# EAGLE design MainControllerV1 (EAGLE 9.3.1)
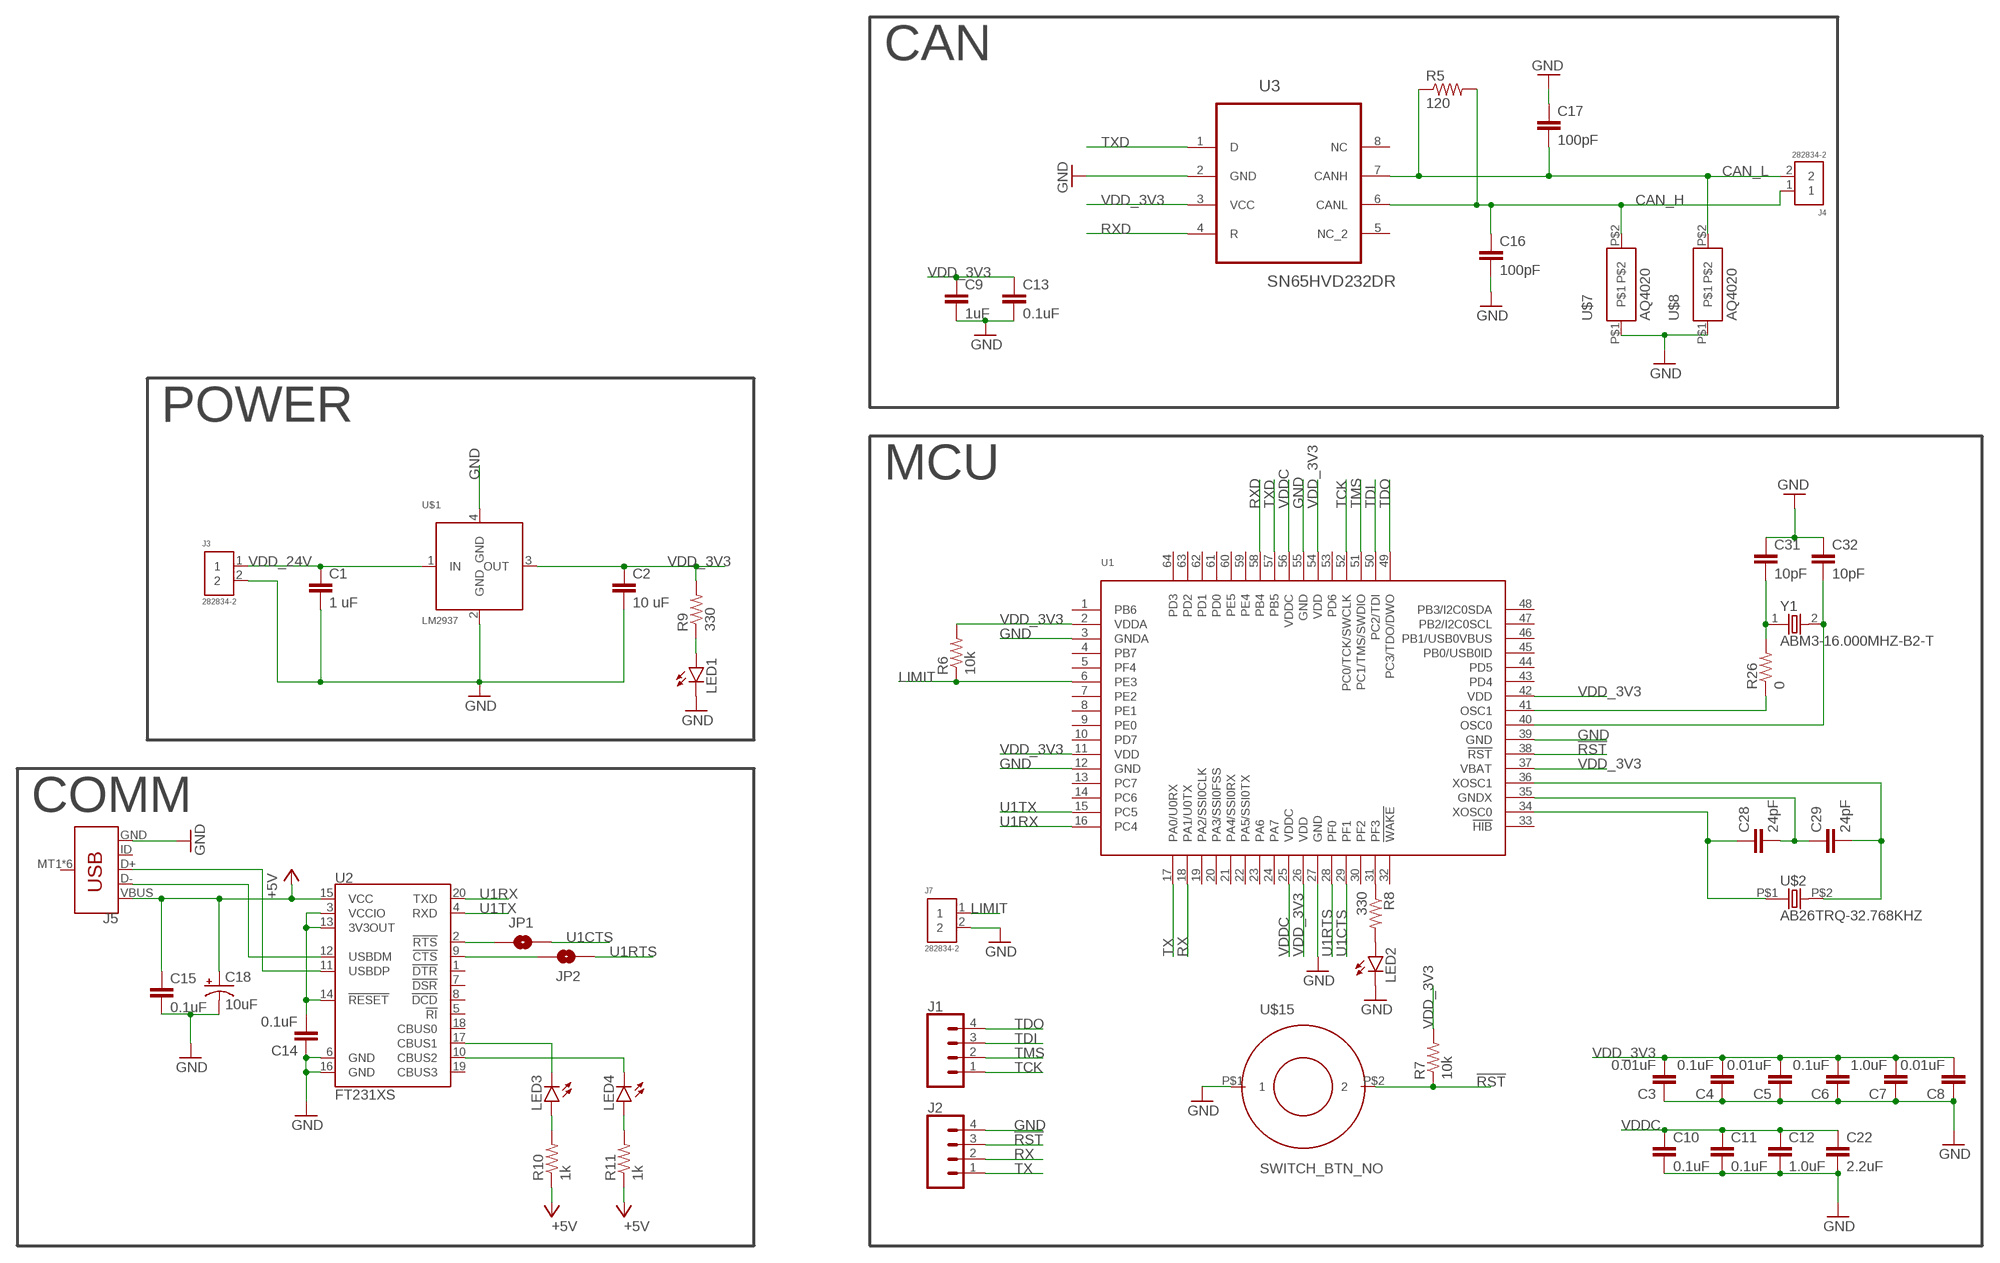
[diagram p0: schematic, sheet 1]

## Parts
C1  1 uF  CAP  [0805]
C2  10 uF  CAP  [0805]
C3  0.01uF  CAP  [0805]
C4  0.1uF  CAP  [0805]
C5  0.01uF  CAP  [0805]
C6  0.1uF  CAP  [0805]
C7  1.0uF  CAP  [0603]
C8  0.01uF  CAP  [0805]
C9  1uF  CAP  [0603]
C10  0.1uF  CAP  [0805]
C11  0.1uF  CAP  [0805]
C12  1.0uF  CAP  [0603]
C13  0.1uF  CAP  [0805]
C14  0.1uF  CAP  [0603]
C15  0.1uF  CAP  [0603]
C16  100pF  CAP  [0603]
C17  100pF  CAP  [0603]
C18  10uF  10UF-POLAR-EIA3216-16V-10%(TANT)  [EIA3216]
C22  2.2uF  CAP  [0805]
C28  24pF  CAP  [0805]
C29  24pF  CAP  [0805]
C31  10pF  CAP  [0805]
C32  10pF  CAP  [0805]
J1  CONN_04  [1X04]
J2  CONN_04  [1X04]
J3  282834-2  [CONN_282834-2]
J4  282834-2  [CONN_282834-2]
J5  USB_MICRO-B_SMT  [USB-MICROB]
J7  282834-2  [CONN_282834-2]
JP1  JUMPER-SMT_2_NO_SILK  [SMT-JUMPER_2_NO_SILK]
JP2  JUMPER-SMT_2_NO_SILK  [SMT-JUMPER_2_NO_SILK]
LED1  LED0603  [LED-0603]
LED2  LED0603  [LED-0603]
LED3  LED0603  [LED-0603]
LED4  LED0603  [LED-0603]
R5  120  RES  [0603]
R6  10k  RES  [0603]
R7  10k  RES  [0603]
R8  330  RES  [0603]
R9  330  RES  [0603]
R10  1k  RES  [0603]
R11  1k  RES  [0603]
R26  0  RES  [0603]
U1  TM4C123GH6PMI  [QFP50P1200X1200X160-64N]
U2  FT231XS  [SSOP20_L]
U3  SN65HVD232DR  [SOIC127P600X175-8N]
U$1  LM2937  [R-PDSO-G4]
U$2  AB26TRQ-32.768KHZ  [AB26TRQ]
U$7  AQ4020  [SOD323]
U$8  AQ4020  [SOD323]
U$15  SWITCH_BTN_NO  [BTN_2]
Y1  ABM3-16.000MHZ-B2-T  [XTAL500X320X130N]

## Nets
!RST: J2.3 R7.P$1 U1.38(!RST) U$15.P$2
+5V: C15.P$1 C18.+ J5.VBUS R10.P$1 R11.P$1 U2.15(VCC)
CAN_H: C16.P$1 J4.1 R5.P$2 U3.6(CANL) U$7.P$2
CAN_L: C17.P$2 J4.2 R5.P$1 U3.7(CANH) U$8.P$2
GND: C1.2 C2.2 C3.1 C4.1 C5.1 C6.1 C7.P$1 C8.1 C9.P$2 C10.2 C11.2 C12.P$2 C13.2 C14.P$1 C15.P$2 C16.P$2 C17.P$1 C18.- C22.2 C31.1 C32.1 J2.4 J3.2 J5.GND J7.2 LED1.C LED2.C U1.3(GNDA) U1.12(GND) U1.27(GND) U1.39(GND) U1.55(GND) U2.6(GND) U2.16(GND) U3.2(GND) U$1.2(GND) U$1.4(GND) U$7.P$1 U$8.P$1 U$15.P$1
LIMIT: J7.1 R6.P$1 U1.6(PE3)
N$1: C29.2 U1.36(XOSC1) U$2.P$2
N$2: C28.1 U1.34(XOSC0) U$2.P$1
N$3: C28.2 C29.1 U1.35(GNDX)
N$4: R26.P$1 U1.41(OSC1)
N$5: LED1.A R9.P$1
N$6: C31.2 R26.P$2 Y1.1
N$7: C32.2 U1.40(OSC0) Y1.2
N$8: LED3.A R10.P$2
N$9: C14.P$2 U2.3(VCCIO) U2.13(3V3OUT) U2.14(!RESET)
N$10: LED3.C U2.17(CBUS1)
N$11: J5.D- U2.12(USBDM)
N$12: J5.D+ U2.11(USBDP)
N$13: LED4.C U2.10(CBUS2)
N$14: LED4.A R11.P$2
N$15: JP2.2 U2.9(!CTS)
N$16: JP1.1 U2.2(!RTS)
N$18: R8.P$1 U1.31(PF3)
N$19: LED2.A R8.P$2
RX: J2.2 U1.18(PA1/U0TX)
RXD: U1.58(PB4) U3.4(R)
TCK: J1.1 U1.52(PC0/TCK/SWCLK)
TDI: J1.3 U1.50(PC2/TDI)
TDO: J1.4 U1.49(PC3/TDO/DWO)
TMS: J1.2 U1.51(PC1/TMS/SWDIO)
TX: J2.1 U1.17(PA0/U0RX)
TXD: U1.57(PB5) U3.1(D)
U1CTS: JP1.2 U1.29(PF1)
U1RTS: JP2.1 U1.28(PF0)
U1RX: U1.16(PC4) U2.20(TXD)
U1TX: U1.15(PC5) U2.4(RXD)
VDD_3V3: C2.1 C3.2 C4.2 C5.2 C6.2 C7.P$2 C8.2 C9.P$1 C13.1 R6.P$2 R7.P$2 R9.P$2 U1.2(VDDA) U1.11(VDD) U1.26(VDD) U1.37(VBAT) U1.42(VDD) U1.54(VDD) U3.3(VCC) U$1.3(OUT)
VDD_24V: C1.1 J3.1 U$1.1(IN)
VDDC: C10.1 C11.1 C12.P$1 C22.1 U1.25(VDDC) U1.56(VDDC)
Unconnected: J5.ID J5.MT1(SHIELD) J5.MT2(SHIELD) J5.MT3(SHIELD) J5.MT4(SHIELD) J5.P$1(SHIELD) J5.P$2(SHIELD) U1.1(PB6) U1.4(PB7) U1.5(PF4) U1.7(PE2) U1.8(PE1) U1.9(PE0) U1.10(PD7) U1.13(PC7) U1.14(PC6) U1.19(PA2/SSI0CLK) U1.20(PA3/SSI0FSS) U1.21(PA4/SSI0RX) U1.22(PA5/SSI0TX) U1.23(PA6) U1.24(PA7) U1.30(PF2) U1.32(!WAKE) U1.33(!HIB) U1.43(PD4) U1.44(PD5) U1.45(PB0/USB0ID) U1.46(PB1/USB0VBUS) U1.47(PB2/I2C0SCL) U1.48(PB3/I2C0SDA) U1.53(PD6) U1.59(PE4) U1.60(PE5) U1.61(PD0) U1.62(PD1) U1.63(PD2) U1.64(PD3) U2.1(!DTR) U2.5(!RI) U2.7(!DSR) U2.8(!DCD) U2.18(CBUS0) U2.19(CBUS3) U3.5(NC_2) U3.8(NC)

## Notes on the sheet
- CAN
- POWER
- MCU
- COMM

## Library data of the parts
C1-C6 C8 C10 C11 C13 C22 C28 C29 C31 C32 = Ilya_Teach:CAP
C7 C9 C12 C14-C17 = MicahLBR:CAP
C18 = SparkFun-Capacitors:10UF-POLAR: 10.0µF polarized capacitors A capacitor is a passive two-terminal electrical component used to store electrical energy temporarily in an electric field.; PROD_ID: CAP-00811
J1 J2 = SparkFun-Connectors:CONN_04: Multi connection point. Often used as Generic Header-pin footprint for 0.1 inch spaced/style header connections On any of the 0.1 inch spaced packages, you can populate with these: Break Away Headers - Straight <https://www.sparkfun.com/products/116> (PRT-00116) Break Away Male Headers - Right Angle <https://www.sparkfun.com/products/553> (PRT-00553) Female Headers <https://www.sparkfun.com/products/115> (PRT-00115) Break Away Headers - Machine Pin <https://www.sparkfun.com/products/117> (PRT-00117) Break Away Female Headers - Swiss Machine Pin <https://www.sparkfun.com/products/743> (PRT-00743) For SCREWTERMINALS and SPRING TERMINALS visit here: Screw Terimnals on SparkFun.com <https://www.sparkfun.com/search/results?term=Screw+Terminals> (5mm/3.5mm/2.54mm spacing) This device is also useful as a general connection point to wire up your design to another part of your project. Our various solder wires solder well into these plated through hole pads. Hook-Up Wire - Assortment (Stranded, 22 AWG) <https://www.sparkfun.com/products/11375> (PRT-11375) Hook-Up Wire - Assortment (Solid Core, 22 AWG) <https://www.sparkfun.com/products/11367> (PRT-11367) View the entire wire category on our website here <https://www.sparkfun.com/categories/141> Special notes: Molex polarized connector foot print use with SKU : PRT-08231 with associated crimp pins and housings. 1MM SMD Version SKU: PRT-10208; PROD_ID: CONN-09696
J3 J4 J7 = 282834-2:282834-2: Terminal block; 2.54mm; angled 90°; 0.03÷1mm2; ways: 2; 10A; H: 10mm; CENTERLINE_PITCH: 2.54 mm[.1 in]; COMMENT: 282834-2; DESCRIPTION: TERMI-BLOK PCB MOUNT, 90 2P.; DIGI-KEY_PART_NUMBER: A98333-ND; DIGI-KEY_PURCHASE_URL: https://www.digikey.com/product-detail/en/te-connectivity-amp-connectors/282834-2/A98333-ND/1150135?utm_source=snapeda&utm_medium=aggregator&utm_campaign=symbol; EU_ROHS_COMPLIANCE: Compliant with Exemptions; MF: TE Connectivity; MP: 282834-2; NUMBER_OF_POSITIONS: 2; PACKAGE: None; TE_PURCHASE_URL: https://www.te.com/usa-en/product-282834-2.html?te_bu=Cor&te_type=disp&te_campaign=seda_glo_cor-seda-global-disp-prtnr-fy19-seda-model-bom-cta_sma-317_1&elqCampaignId=32493
J5 = MicahLBR:USB_MICRO-B: USB Type Micro-B Connector Male/female and PTH/SMT variants SparkFun Products: SparkFun microB USB Breakout <https://www.sparkfun.com/products/12035> SparkFun USB microB Plug Breakout <https://www.sparkfun.com/products/10031> SparkFun ESP8266 Thing <https://www.sparkfun.com/products/13231>; PROD_ID: CONN-09505; SF_ID: PRT-08533
JP1 JP2 = SparkFun-Jumpers:JUMPER-SMT_2_NO: Normally open jumper This jumper has two pads in close proximity to each other. Apply solder to close the connection. Round pads are easier to solder for beginners, but are a lot larger. SparkFun Product that uses the round pads: SparkFun EL Sequencer <https://www.sparkfun.com/products/12781>
LED1-LED4 = Ilya_Teach:LED: LEDs Standard schematic elements and footprints for 5mm, 3mm, 1206, and 0603 sized LEDs. 5mm - Spark Fun Electronics SKU : COM-00529 (and others)
R5-R11 R26 = MicahLBR:RES
U1 = TM4C123GH6PMI:TM4C123GH6PMI: MCU 32-Bit Tiva C ARM Cortex M4F RISC 256KB Flash 1.2V/3.3V 64-Pin LQFP Tray/Tube; AVAILABILITY: Unavailable; DESCRIPTION: MCU 32-Bit Tiva C ARM Cortex M4F RISC 256KB Flash 1.2V/3.3V 64-Pin LQFP Tray/Tube; MF: Texas Instruments; MP: TM4C123GH6PMI; PACKAGE: LQFP-64 Texas Instruments; PRICE: None
U2 = SparkFun-IC-Comms:FT231X: FTDI FT231X Full Speed USB to Full-handshake UART This USB2.0 Full Speed IC offers a compact bridge to full handshake UART interfaces. The device is a UART, capable of operating up to 3MBaud, with low power consumption (8mA). The FT231X includes the complete FT-X series feature set and enables USB to be added into a system design quickly and easily over a UART interface. Datasheet <http://cdn.sparkfun.com/datasheets/Components/General%20IC/DS_FT231X.pdf> SparkFun Products SparkFun RedBoard - Programmed with Arduino <https://www.sparkfun.com/products/12757> (DEV-12757) SparkFun XBee Explorer USB <https://www.sparkfun.com/products/11812> (WRL-11812) SparkFun XBee Explorer Dongle <https://www.sparkfun.com/products/11697> (WRL-11697) SparkFun Blynk Board - ESP8266 <https://www.sparkfun.com/products/13794> (WRL-13794) SparkFun ESP8266 Thing - Dev Board <https://www.sparkfun.com/products/13711> (WRL-13711) SparkFun Block for Intel® Edison - Base <https://www.sparkfun.com/products/13045> (DEV-13045) SparkFun RedStick <https://www.sparkfun.com/products/13741> (DEV-13741) SparkFun Beefy 3 - FTDI Basic Breakout <https://www.sparkfun.com/products/13746> (DEV-13746) SparkFun FT231X Breakout <https://www.sparkfun.com/products/11736> (BOB-11736); PROD_ID: IC-11524
U3 = SN65HVD232DR:SN65HVD232DR: 3.3-V CAN TRANSCEIVERS; AVAILABILITY: Unavailable; DESCRIPTION: CAN 1Mbps 3.3V Industrial 8-Pin SOIC T/R; MF: Texas Instruments; MP: SN65HVD232DR; PACKAGE: SOIC-8 Texas Instruments; PRICE: None
U$1 = MicahLBR:LM2937
U$2 = MicahLBR:AB26TRQ-32.768KHZ
U$7 U$8 = MicahLBR:AQ4020
U$15 = Ilya_Teach:SWITCH_BTN_NO
Y1 = ABM3-16.000MHZ-B2-T:ABM3-16.000MHZ-B2-T: Crystals 12MHz 18pF 30ppm -40C +85C; AVAILABILITY: Unavailable; DESCRIPTION: Crystal 16MHz Ø·Â¢Ø¢Â±20ppm _Tol_ Ø·Â¢Ø¢Â±50ppm _Stability_ 18pF FUND 50Ohm 2-Pin CSMD T/R; MF: Abracon; MP: ABM3-16.000MHZ-B2-T; PACKAGE: SMD-2 Abracon; PRICE: None

## Board
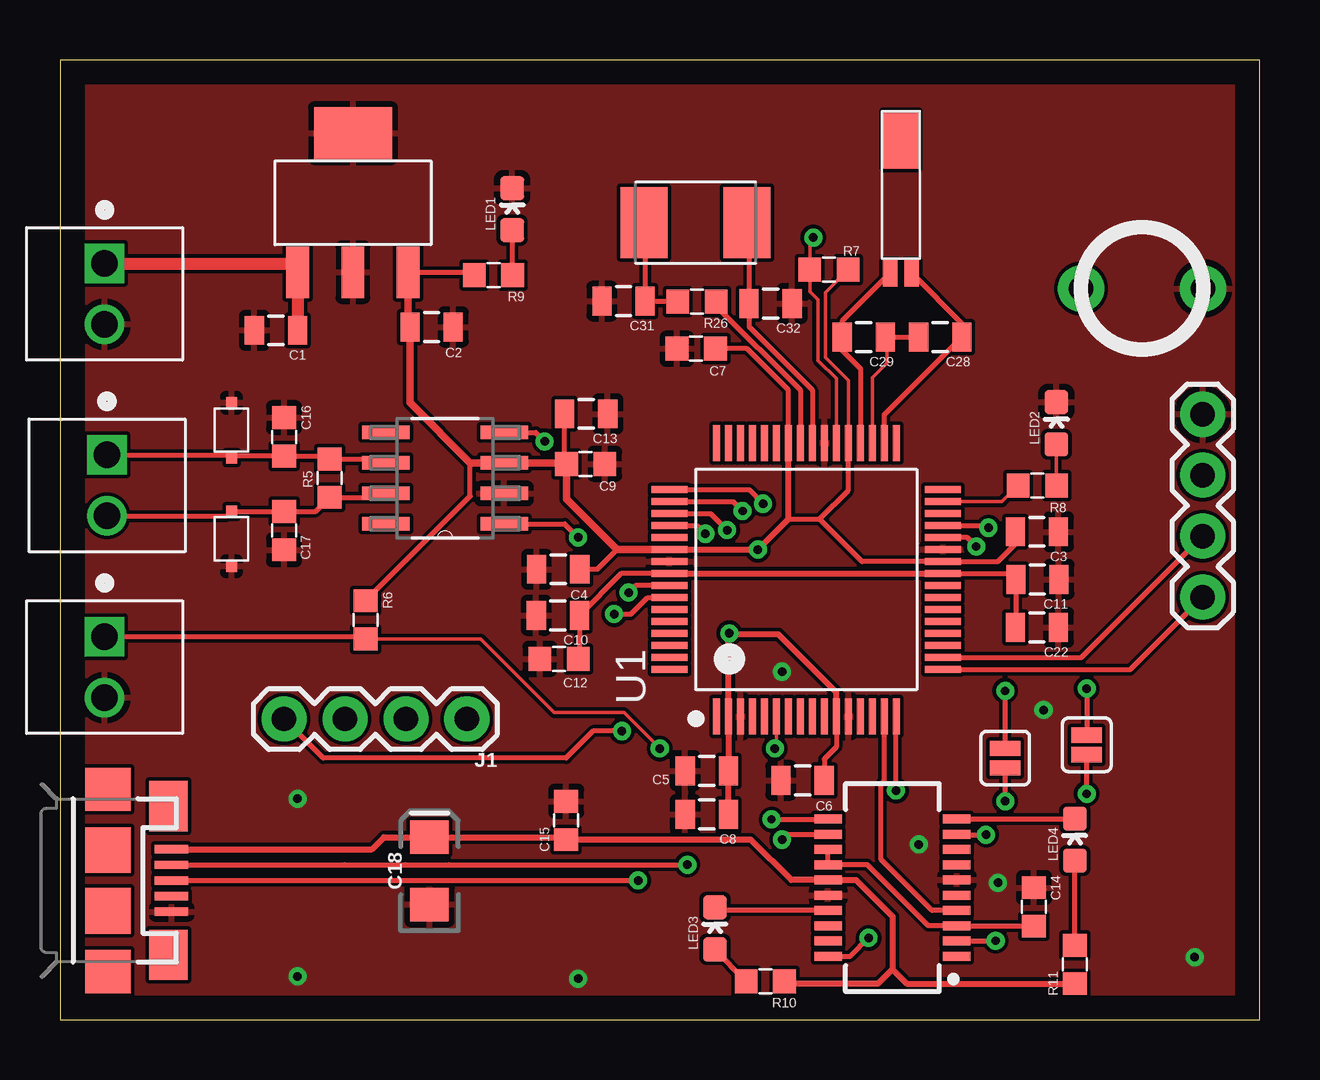
[diagram p1: board, top side]
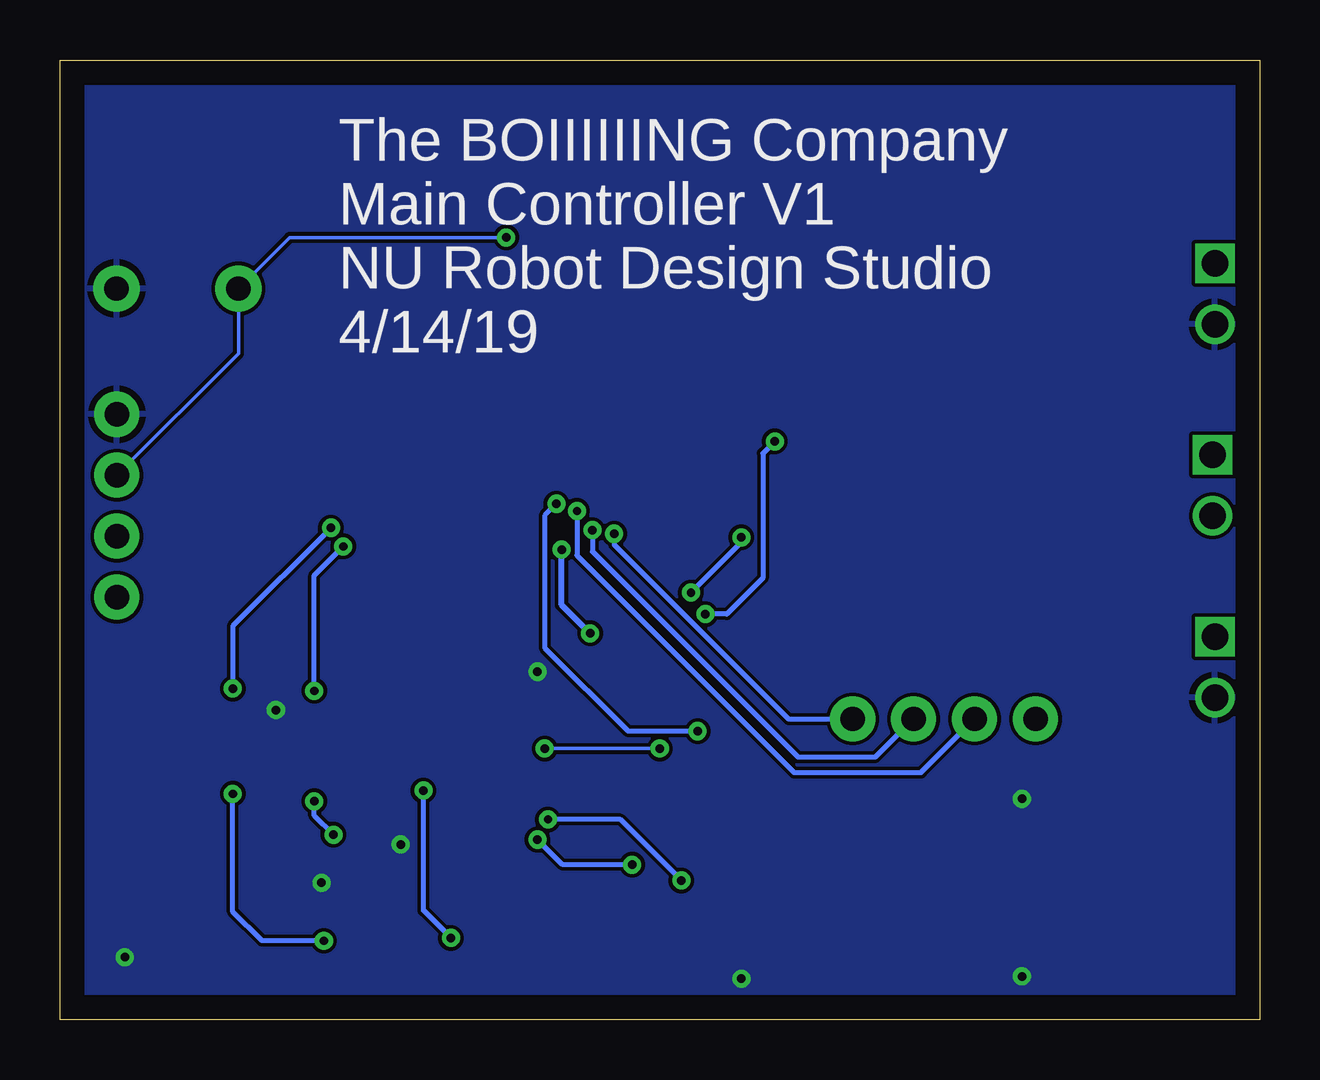
[diagram p2: board, bottom side, seen from below]

Size 50 x 40 mm. Coordinates in mm from the lower left corner, seen from the top.
Outline: 0,0 50,0 50,40 0,40 0,0
Copper layers (1*16): Top 0.035mm / dielectric 1.5mm / Bottom 0.035mm
Design rules "default": minimum track width 6mil, minimum drill 0.35mm, track to track 6mil, track to pad 6mil, pad to pad 6mil, via to via 6mil, smd to smd 6mil, copper to edge 40mil, drill to drill 6mil, minimum pad ring 10mil, minimum via ring 8mil, stop-mask expansion 4mil, vias tented up to drill 0mil, thermal gap 10mil

### Footprints (pad centres in the part's own frame; a part is rotated, then mirrored left to right if it is on the bottom)
0805 = smd 0.8 x 1.2: 1 -0.9,0; 2 0.9,0
0603 = smd 0.95 x 1: P$1 -0.8,0; P$2 0.8,0
EIA3216 = smd 1.4 x 1.6: + 1.4,0; - -1.4,0
1X04 = drill 1.016 pad 1.88: 1 0,0; 2 2.54,0; 3 5.08,0; 4 7.62,0
CONN_282834-2 = drill 1.1 square: 1 -1.27,0 | drill 1.1: 2 1.27,0
USB-MICROB = smd 1.4 x 0.35: D+ -2.65,0; D- -2.65,-0.65; GND -2.65,1.3; ID -2.65,0.65; VBUS -2.65,-1.3 | smd 1.9 x 1.8: MT1 0,-3.8; MT2 0,3.8 | smd 1.6 x 2.1: MT3 -2.52,-3.1; MT4 -2.52,3.1 | smd 1.9 x 1.9: P$1 0,-1.27; P$2 0,1.27
SMT-JUMPER_2_NO_SILK = smd 0.635 x 1.27: 1 -0.406,0; 2 0.406,0
LED-0603 = smd 1 x 1: A 0,-0.877; C 0,0.877
QFP50P1200X1200X160-64N = smd 1.5 x 0.3: 1 -5.7,3.75; 2 -5.7,3.25; 3 -5.7,2.75; 4 -5.7,2.25; 5 -5.7,1.75; 6 -5.7,1.25; 7 -5.7,0.75; 8 -5.7,0.25; 9 -5.7,-0.25; 10 -5.7,-0.75; 11 -5.7,-1.25; 12 -5.7,-1.75; 13 -5.7,-2.25; 14 -5.7,-2.75; 15 -5.7,-3.25; 16 -5.7,-3.75; 33 5.7,-3.75; 34 5.7,-3.25; 35 5.7,-2.75; 36 5.7,-2.25; 37 5.7,-1.75; 38 5.7,-1.25; 39 5.7,-0.75; 40 5.7,-0.25; 41 5.7,0.25; 42 5.7,0.75; 43 5.7,1.25; 44 5.7,1.75; 45 5.7,2.25; 46 5.7,2.75; 47 5.7,3.25; 48 5.7,3.75 | smd 0.3 x 1.5: 17 -3.75,-5.7; 18 -3.25,-5.7; 19 -2.75,-5.7; 20 -2.25,-5.7; 21 -1.75,-5.7; 22 -1.25,-5.7; 23 -0.75,-5.7; 24 -0.25,-5.7; 25 0.25,-5.7; 26 0.75,-5.7; 27 1.25,-5.7; 28 1.75,-5.7; 29 2.25,-5.7; 30 2.75,-5.7; 31 3.25,-5.7; 32 3.75,-5.7; 49 3.75,5.7; 50 3.25,5.7; 51 2.75,5.7; 52 2.25,5.7; 53 1.75,5.7; 54 1.25,5.7; 55 0.75,5.7; 56 0.25,5.7; 57 -0.25,5.7; 58 -0.75,5.7; 59 -1.25,5.7; 60 -1.75,5.7; 61 -2.25,5.7; 62 -2.75,5.7; 63 -3.25,5.7; 64 -3.75,5.7
SSOP20_L = smd 0.381 x 1.143: 1 -2.857,-2.68; 2 -2.223,-2.68; 3 -1.587,-2.68; 4 -0.953,-2.68; 5 -0.318,-2.68; 6 0.318,-2.68; 7 0.953,-2.68; 8 1.587,-2.68; 9 2.223,-2.68; 10 2.857,-2.68; 11 2.857,2.68; 12 2.223,2.68; 13 1.587,2.68; 14 0.953,2.68; 15 0.318,2.68; 16 -0.318,2.68; 17 -0.953,2.68; 18 -1.587,2.68; 19 -2.223,2.68; 20 -2.857,2.68
SOIC127P600X175-8N = smd 1.981 x 0.559: 1 -2.464,1.905; 2 -2.464,0.635; 3 -2.464,-0.635; 4 -2.464,-1.905; 5 2.464,-1.905; 6 2.464,-0.635; 7 2.464,0.635; 8 2.464,1.905
R-PDSO-G4 = smd 0.95 x 2.15: 1 -2.3,-2.9; 2 0,-2.9; 3 2.3,-2.9 | smd 3.25 x 2.15: 4 0,2.9
AB26TRQ = smd 1.1 x 0.6: P$1 2.45,0.45; P$2 2.45,-0.45 | smd 2.4 x 1.5: P$3 -3.1,0
SOD323 = smd 0.49 x 0.45: P$1 1.14,0; P$2 -1.14,0
BTN_2 = drill 1.016 pad 1.93: P$1 -2.54,0; P$2 2.54,0
XTAL500X320X130N = smd 1.95 x 2.95: 1 -2.15,0; 2 2.15,0

### Placement (x,y rotation side)
C1  9,28.73 180 top
C2  15.49,28.87 0 top
C3  40.72,20.33 180 top
C4  20.77,18.77 0 top
C5  26.96,10.37 0 top
C6  30.95,9.97 0 top
C7  26.52,27.96 0 top
C8  26.96,8.55 0 top
C9  21.91,23.16 0 top
C10  20.75,16.85 180 top
C11  40.74,18.35 0 top
C12  20.8,15.04 180 top
C13  21.93,25.25 0 top
C14  40.6,4.7 270 top
C15  21.1,8.3 90 top
C16  9.34,24.29 90 top
C17  9.34,20.38 90 top
C18  15.4,6.2 90 top
C22  40.72,16.35 0 top
C28  36.69,28.45 180 top
C29  33.5,28.45 180 top
C31  23.49,29.95 0 top
C32  29.62,29.85 180 top
J1  16.96,12.53 180 top
J2  47.63,17.61 90 top
J3  1.86,30.25 270 top
J4  1.96,22.27 270 top
J5  2,5.8 180 top
J7  1.86,14.69 270 top
JP1  42.8,11.45 90 top
JP2  39.4,10.9 270 top
LED1  18.85,33.78 0 top
LED2  41.53,24.86 0 top
LED3  27.3,3.8 0 top
LED4  42.3,7.5 0 top
R5  11.24,22.57 90 top
R6  12.74,16.66 90 top
R7  32.05,31.26 0 top
R8  40.74,22.26 0 top
R9  18.07,31.04 180 top
R10  29.4,1.6 180 top
R11  42.3,2.3 90 top
R26  26.55,29.93 180 top
U1  31.11,18.34 90 top
U2  34.7,5.5 90 top
U3  16.05,22.57 180 top
U$1  12.21,34.05 0 top
U$2  35.05,33.56 270 top
U$7  7.15,24.57 90 top
U$8  7.15,20.04 270 top
U$15  45.1,30.47 180 top
Y1  26.49,33.22 0 top

### Tracks (layer width: path | path; a pad name or v marks a point on that pad's centre or on a via)
!RST  (via drill 0.35)
  Top 0.152: v31.4,32.6 31.25,32.45 R7.P$1 31.25,30.35 31.59,30 31.59,27.47 32.36,26.71 U1.38
  Bottom 0.152: v31.4,32.6 40.43,32.6 U$15.P$2 42.56,27.76 J2.3
+5V
  Top 0.254: 34.7,2.1 34.7,4.3 33.18,5.82 U2.15 30.48,5.82 28.8,7.5 C15.P$1 21,7.6 C18.+ 13.5,7.6 13,7.1 J5.VBUS | 34.7,2.1 34.1,1.5 30.3,1.5 R10.P$1 | 34.7,2.1 35.3,1.5 R11.P$1
CAN_H
  Top 0.2: J4.1 7.04,23.54 U$7.P$2 7.21,23.49 C16.P$1 11.12,23.49 R5.P$2 13.42,23.37 U3.6
CAN_L
  Top 0.2: J4.2 6.97,21 U$8.P$2 C17.P$2 10.65,21.18 R5.P$1 13.42,21.77 U3.7
GND  (via drill 0.35)
  other vias: 9.9,9.2 9.9,1.8 21.6,1.7 35.8,7.3 47.3,2.6 39.1,5.7 30.1,14.5 41,12.9
  pour Top: 0,0 50,0 50,50.3 0,50.3
  pour Bottom: 0,0 50,0 50,50.3 0,50.3
LIMIT  (via drill 0.35)
  Top 0.152: R6.P$1 17.54,15.86 20.6,12.8 23.5,12.8 v25,11.3 | U1.6 29.86,11.36 v29.8,11.3
  Top 0.2: J7.1 12.64,15.96 R6.P$1
  Bottom 0.152: v29.8,11.3 v25,11.3
N$1
  Top 0.2: U$2.P$2 32.6,29.11 C29.2 32.6,27.9 33.36,27.14 U1.36
N$2
  Top 0.2: U$2.P$1 37.59,29.02 C28.1 34.36,25.22 U1.34
N$3
  Top 0.152: U1.35 33.86,26.76 34.46,27.36 34.46,28.39
  Top 0.2: C28.2 C29.1 34.46,28.39
N$4
  Top 0.2: R26.P$1 27.35,29.75 30.86,26.24 U1.41
N$5
  Top 0.2: R9.P$1 18.87,32.88 LED1.A
N$6
  Top 0.2: Y1.1 24.39,33.17 C31.2 25.73,29.95 R26.P$2
N$7
  Top 0.2: Y1.2 28.72,33.14 C32.2 28.72,28.88 31.36,26.24 U1.40
N$8
  Top 0.2: LED3.A 27.3,2.9 R10.P$2
N$9
  Top 0.2: C14.P$2 40.59,3.91 U2.3 36.19,3.91 33.65,6.45 U2.14 U2.13
N$10
  Top 0.2: U2.17 27.43,4.55 LED3.C
N$11  (via drill 0.35)
  Top 0.2: J5.D- 11.85,6.45 14.39,6.45 16.2,6.45 16.21,6.45 v26.15,6.45 | v30.1,7.5 30.32,7.72 U2.12
  Bottom 0.2: v26.15,6.45 29.05,6.45 v30.1,7.5
N$12  (via drill 0.35)
  Top 0.2: U2.11 31.96,8.3 31.92,8.34 v29.66,8.34 | J5.D+ v24.1,5.8
  Bottom 0.2: v24.1,5.8 26.64,8.34 v29.66,8.34
N$13
  Top 0.2: U2.10 42.28,8.36 LED4.C
N$14
  Top 0.2: R11.P$2 LED4.A
N$15  (via drill 0.35)
  Top 0.2: U2.9 37.4,7.7 v38.6,7.7 | v39.4,9.1 JP2.2
  Bottom 0.2: v38.6,7.7 39.4,8.5 v39.4,9.1
N$16  (via drill 0.35)
  Top 0.2: U2.2 v39,3.28 | v42.8,9.41 JP1.1
  Bottom 0.2: v39,3.28 41.58,3.28 42.8,4.5 v42.8,9.41
N$18
  Top 0.152: U1.31 39.27,21.59 R8.P$1
N$19
  Top 0.152: R8.P$2 LED2.A
RX
  Top 0.2: J2.2 42.57,15.09 U1.18
RXD  (via drill 0.35)
  Top 0.2: U3.4 19.82,24.48 v20.2,24.1 | v23.1,16.9 23.8,16.9 24.49,17.59 U1.58
  Bottom 0.2: v20.2,24.1 20.7,23.6 20.7,18.4 22.2,16.9 v23.1,16.9
TCK  (via drill 0.35)
  Top 0.2: U1.52 26.56,20.59 v26.9,20.25
  Bottom 0.2: v26.9,20.25 26.9,19.8 19.63,12.53 J1.1
TDI  (via drill 0.35)
  Top 0.2: U1.50 28.06,21.59 v28.45,21.2
  Bottom 0.2: v28.45,21.2 28.45,19.35 19.4,10.3 14.11,10.3 J1.3
TDO  (via drill 0.35)
  Top 0.2: U1.49 28.72,22.09 v29.31,21.5 | J1.4 10.97,10.9 21.1,10.9 22.22,12.02 v23.42,12.02
  Bottom 0.2: v29.31,21.5 29.8,21.01 29.8,15.5 26.32,12.02 v23.42,12.02
TMS  (via drill 0.35)
  Top 0.2: U1.51 27.12,21.09 v27.81,20.4
  Bottom 0.2: v27.81,20.4 27.81,19.51 19.24,10.94 16.01,10.94 J1.2
TX
  Top 0.2: U1.17 44.61,14.59 J2.1
TXD  (via drill 0.35)
  Top 0.2: U3.1 21.04,20.66 v21.6,20.1 | U1.57 23.99,18.09 v23.7,17.8
  Bottom 0.2: v23.7,17.8 21.6,19.9 v21.6,20.1
U1CTS  (via drill 0.35)
  Top 0.2: U1.29 38.61,20.59 v38.7,20.5 | v42.8,13.8 JP1.2
  Bottom 0.2: v38.7,20.5 42.8,16.4 v42.8,13.8
U1RTS  (via drill 0.35)
  Top 0.2: JP2.1 v39.4,13.7 | v38.19,19.72 37.83,20.09 U1.28
  Bottom 0.2: v39.4,13.7 39.4,18.52 v38.19,19.72
U1RX  (via drill 0.35)
  Top 0.2: U2.20 32.94,2.64 v33.7,3.4 | v34.85,9.55 U1.16
  Bottom 0.2: v33.7,3.4 34.85,4.55 v34.85,9.55
U1TX
  Top 0.2: U2.4 36.35,4.55 34.22,6.68 34.22,9.81 34.25,9.84 34.25,9.85 34.36,9.96 U1.15
VDD_3V3  (via drill 0.35)
  Top 0.152: U1.37 32.86,26.64 31.9,27.6 31.9,30.31 R7.P$2
  Top 0.2: U$1.3 17.16,31.15 R9.P$2 | 23.21,19.59 22.39,18.77 C4.2 | C9.P$1 21.03,23.24 C13.1 | U1.42 30.36,26.24 28.64,27.96 C7.P$2 | 30.36,20.86 31.66,20.86 | U1.37 32.86,22.06 31.66,20.86 | 31.66,20.86 33.43,19.09 U1.26 39.09,19.09 39.82,19.82 C3.2 | R6.P$2 17.09,21.82 17.09,23.2 | C6.2 31.86,10.86 32.36,11.36 U1.11
  Top 0.254: 14.51,28.95 C2.1 | U1.54 v29.09,19.59 30.36,20.86 U1.42 | C8.2 C5.2 U1.2 27.86,16.06 | 27.86,16.06 v27.9,16.1 | U1.11 32.36,13.64 29.94,16.06 27.86,16.06
  Top 0.305: U$1.3 14.51,28.95 | U1.54 23.21,19.59 21.11,21.69 C9.P$1 21.07,23.2 U3.3 17.09,23.2 14.59,25.71 C2.1
  Bottom 0.254: v27.9,16.1 29.09,17.29 v29.09,19.59
VDD_24V
  Top 0.508: J3.1 9.54,31.52 U$1.1 C1.1
VDDC
  Top 0.2: U1.56 23.39,18.59 C10.1 21.65,15.09 C12.P$1 | U1.25 39.6,18.59 C11.1 39.84,16.37 C22.1
  Top 0.254: U1.56 U1.25

### Text on the board
bPlace: The BOIIIIIING Company / Main Controller V1 / NU Robot Design Studio / 4/14/19